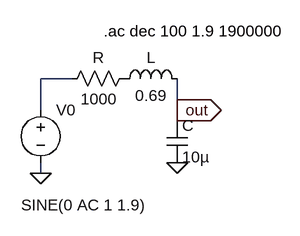
[diagram p0: schematic RLC.asc]
RLC.asc, the LTspice schematic file:
Version 4
SHEET 1 880 680
WIRE 96 128 48 128
WIRE 48 176 48 128
WIRE 256 176 256 128
WIRE 256 192 256 176
WIRE 48 272 48 256
FLAG 48 272 0
FLAG 256 256 0
FLAG 256 176 out
IOPIN 256 176 Out
SYMBOL voltage 48 160 R0
WINDOW 3 -30 161 Left 2
WINDOW 123 -30 189 Left 2
WINDOW 39 0 0 Left 0
SYMATTR InstName V0
SYMATTR Value SINE(0 AC 1 1.9)
SYMBOL res 192 112 R90
WINDOW 0 0 56 VBottom 2
WINDOW 3 32 56 VTop 2
SYMATTR InstName R
SYMATTR Value 1000
SYMBOL ind 160 144 R270
WINDOW 0 32 56 VTop 2
WINDOW 3 5 56 VBottom 2
SYMATTR InstName L
SYMATTR Value 0.69
SYMBOL cap 240 192 R0
SYMATTR InstName C
SYMATTR Value 10µ
TEXT 144 56 Left 2 !.ac dec 100 1.9 1900000

The netlist it stands for:
* RLC.asc
V0 N001 0 SINE(0 AC 1 1.9)
R P001 N001 1000
L P001 out 0.69
C out 0 10µ
.ac dec 100 1.9 1900000
.backanno
.end